# EAGLE design SLIM-PDM (EAGLE 6.1)
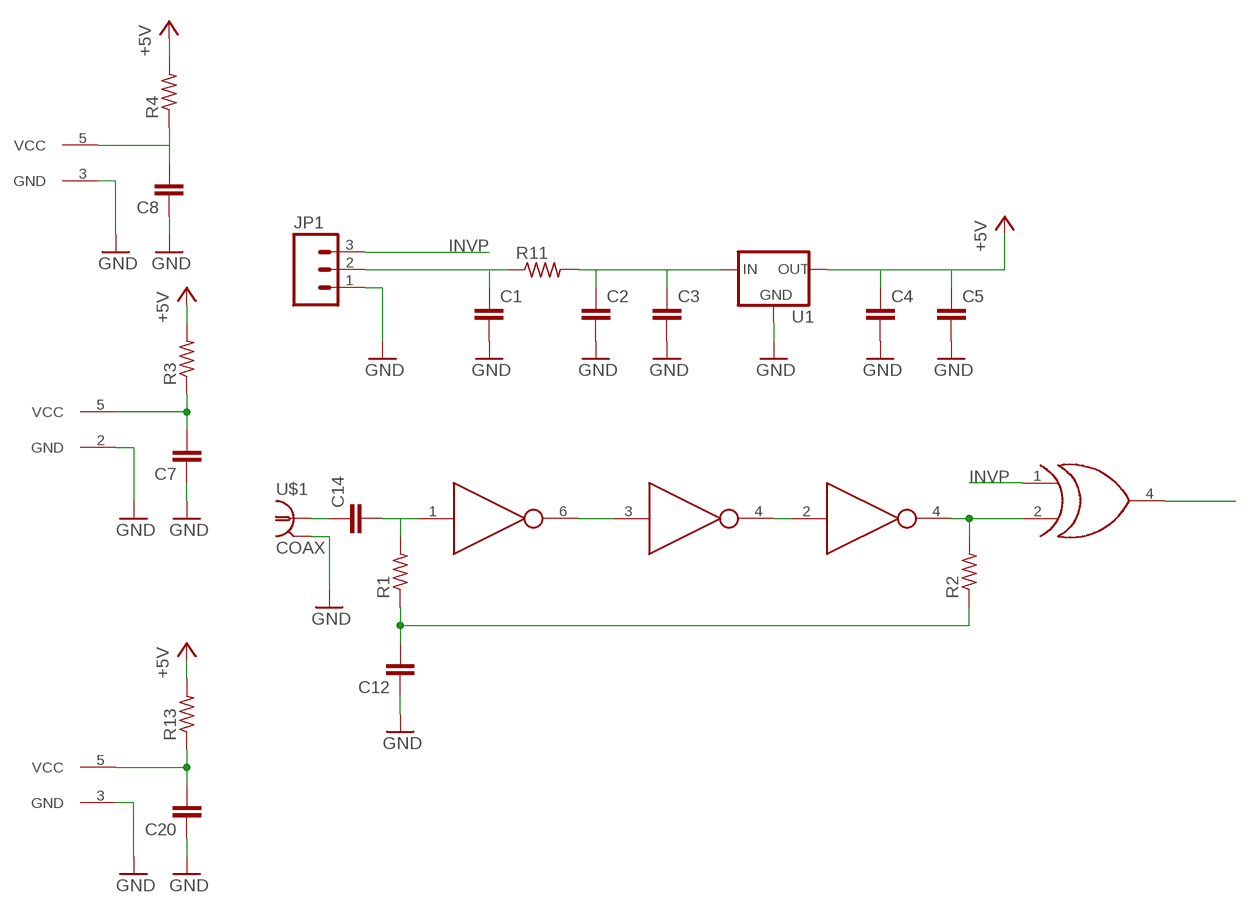
[diagram p0: schematic, sheet 1]

## Parts
C1  C-EUC0805  [C0805]
C2  C-EUC0805  [C0805]
C3  C-EUC1206  [C1206]
C4  C-EUC0805  [C0805]
C5  C-EUC3216  [C3216]
C7  C-EUC0805  [C0805]
C8  C-EUC0805  [C0805]
C12  C-EUC0805  [C0805]
C14  C-EUC0805  [C0805]
C20  C-EUC0805  [C0805]
JP1  M03PTH  [1X03]
R1  R-US_R0805  [R0805]
R2  R-US_R0805  [R0805]
R3  R-US_R0805  [R0805]
R4  R-US_R0805  [R0805]
R11  R-US_R0805  [R0805]
R13  R-US_R0805  [R0805]
U1  78MXXLSOT-89  [SOT89-BCE]
U2  7WZU04  [SC70-6L]
U3  7SZ04  7SZ04SOT-23  [SOT23-5L]
U$1  COAX  [SLIM_COAX_PAD]
U$2  74LVC1G86  [SOT23-5L]

## Nets
+5V: C4.1 C5.1 R3.2 R4.2 R13.2 U1.B(OUT)
GND: C1.2 C2.2 C3.2 C4.2 C5.2 C7.1 C8.1 C12.1 C20.1 JP1.1 U1.C(GND) U2.2(GND) U3.3(GND) U$1.P$2(GND) U$2.3(GND)
INVP: JP1.3 U$2.1(A)
N$1: C14.1 U$1.P$1
N$2: C1.1 JP1.2 R11.1
N$3: C2.1 C3.1 R11.2 U1.E(IN)
N$4: C14.2 R1.2 U2.1(IN)
N$5: U2.3(IN) U2.6(OUT)
N$6: U2.4(OUT) U3.2(IN)
N$7: C7.2 R3.1 U2.5(VCC)
N$8: C12.2 R1.1 R2.1
N$9: C20.2 R13.1 U3.5(VCC)
N$10: R2.2 U3.4(OUT) U$2.2(B)
N$11: U$2.4(Y)
N$12: C8.2 R4.1 U$2.5(VCC)

## Library data of the parts
C1-C5 C7 C8 C12 C14 C20 = rcl:C-EU: CAPACITOR, European symbol
JP1 = SparkFun:M03: Header 3 Standard 3-pin 0.1" header. Use with straight break away headers (SKU : PRT-00116), right angle break away headers (PRT-00553), swiss pins (PRT-00743), machine pins (PRT-00117), and female headers (PRT-00115). Molex polarized connector foot print use with SKU : PRT-08232 with associated crimp pins and housings.
R1-R4 R11 R13 = rcl:R-US_: RESISTOR, American symbol
U1 = SLIM:78MXXL: VOLTAGE REGULATOR
U2 = SLIM:7WZU04
U3 = SLIM:7SZ04
U$1 = SLIM:COAX
U$2 = SLIM:74LVC1G86

## Board
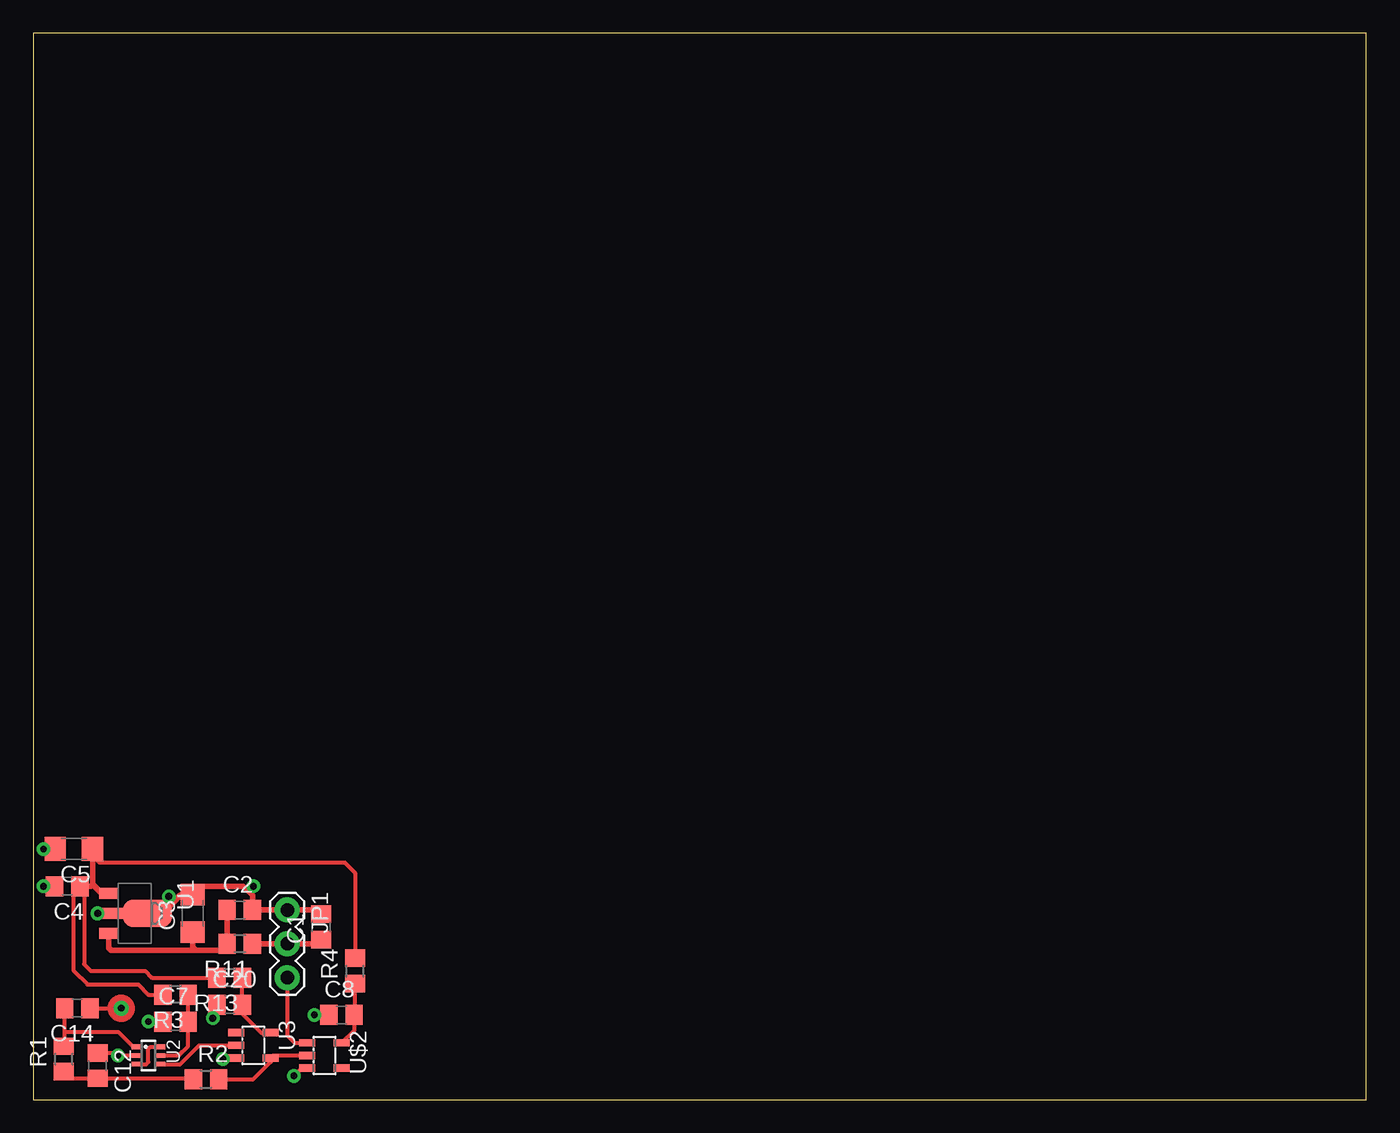
[diagram p1: board, top side]
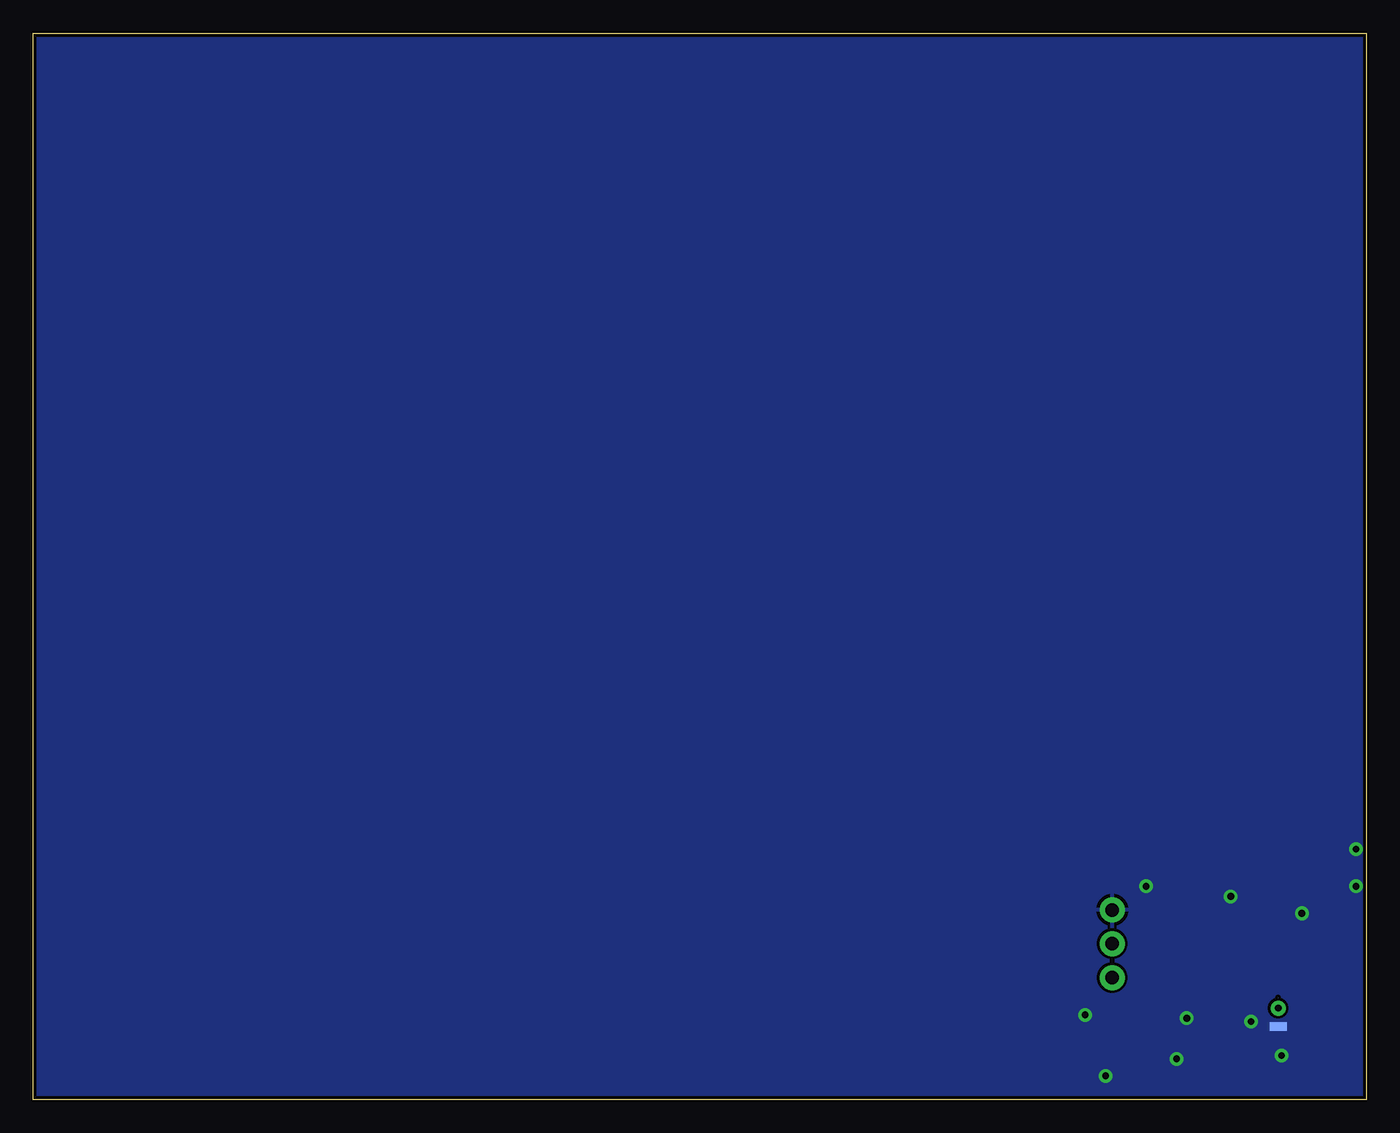
[diagram p2: board, bottom side, seen from below]

Size 100 x 80 mm. Coordinates in mm from the lower left corner, seen from the top.
Outline: 0,0 100,0 100,80 0,80 0,0
Copper layers (1*16): Top 0.035mm / dielectric 1.5mm / Bottom 0.035mm
Design rules: minimum track width 8mil, minimum drill 20mil, track to track 8mil, track to pad 8mil, pad to pad 8mil, via to via 8mil, smd to smd 8mil, copper to edge 10mil, drill to drill 8mil, minimum pad ring 12mil, minimum via ring 10mil, stop-mask expansion 4mil, vias tented up to drill 25mil, thermal gap 10mil

### Footprints (pad centres in the part's own frame; a part is rotated, then mirrored left to right if it is on the bottom)
C0805 = smd 1.3 x 1.5: 1 -0.95,0; 2 0.95,0
C1206 = smd 1.6 x 1.8: 1 -1.4,0; 2 1.4,0
C3216 = smd 1.6 x 1.8: 1 -1.4,0; 2 1.4,0
1X03 = drill 1.016 pad 1.88: 1 0,0; 2 2.54,0; 3 5.08,0
R0805 = smd 1.3 x 1.5: 1 -0.95,0; 2 0.95,0
SOT89-BCE = smd 0.8 x 1.4: B -1.499,-1.981; E 1.499,-1.981 | smd 0.8 x 1.9: C 0,-1.727 | smd 2.032 x 3.65: C@1 0,0.94
SC70-6L = smd 0.35 x 0.8: 1 -0.65,-0.85; 2 0,-0.85; 3 0.65,-0.85; 4 0.65,0.85; 5 0,0.85; 6 -0.65,0.85
SOT23-5L = smd 0.55 x 1.2: 1 -0.95,-1.3; 2 0,-1.3; 3 0.95,-1.3; 4 0.95,1.3; 5 -0.95,1.3
SLIM_COAX_PAD = drill 0.508 pad 1.016: P$1 0,0 | smd 1.27 x 0.635 bottom: P$2 0,-1.397

### Placement (x,y rotation side)
C1  21.59,12.95 90 top
C2  15.49,14.22 0 top
C3  11.94,13.97 90 top
C4  2.54,16 180 top
C5  3.05,18.8 180 top
C7  10.67,5.84 0 top
C8  23.11,6.35 0 top
C12  4.83,2.54 270 top
C14  3.3,6.86 180 top
C20  14.73,7.11 0 top
JP1  19.05,14.22 270 top
R1  2.29,3.05 90 top
R2  12.95,1.52 0 top
R3  10.67,7.87 180 top
R4  24.13,9.65 90 top
R11  15.49,11.68 180 top
R13  14.73,9.14 180 top
U1  7.62,13.97 270 top
U2  8.64,3.3 270 top
U3  16.51,4.06 270 top
U$1  6.6,6.86 0 top
U$2  21.84,3.3 270 top

### Tracks (layer width: path | path; a pad name or v marks a point on that pad's centre or on a via)
+5V
  Top 0.305: R3.2 8.64,7.87 7.87,8.64 4.06,8.64 3.05,9.65 3.05,15.56 C4.1 3.81,15.68 3.81,10.16 4.32,9.65 8.38,9.65 8.89,9.14 R13.2 | R4.2 24.13,17.02 23.37,17.78 4.96,17.78 4.45,18.29
  Top 0.406: 4.45,16.13 4.45,18.29 C5.1 | 4.45,16.13 5.08,15.49 5.61,15.49 U1.B | C4.1 4.32,16 4.45,16.13
GND  (via drill 0.51)
  Top 0.305: U2.2 v6.35,3.3 6.16,3.49 C12.1 | C20.1 13.78,6.42 v13.46,6.1 | C7.1 v8.64,5.84 | U3.3 14.34,3.16 v14.22,3.05 | C4.2 v0.76,16 | C5.2 v0.76,18.8 | C8.1 v21.08,6.35 | U$2.3 20.13,2.35 v19.56,1.78
  Top 0.406: C1.2 21.59,14.22 JP1.1 C2.2 16.44,15.31 15.75,16 12.57,16 C3.2 11.05,15.37 9.65,13.97 U1.C
  other vias: 4.83,13.97 10.16,15.24 16.51,16
  pour Bottom: 0,80.01 100.08,80.01 100.08,0 0,0
INVP
  Top 0.305: U$2.1 19.62,4.25 19.05,4.83 JP1.3
N$1
  Top 0.305: C14.1 U$1.P$1
N$2
  Top 0.406: R11.1 JP1.2 21.59,11.68 C1.1
N$3
  Top 0.406: U1.E 5.64,11.38 5.84,11.18 12.19,11.18 | 12.19,11.18 14.04,11.18 R11.2 C2.1 | C3.1 11.94,11.43 12.19,11.18
N$4
  Top 0.305: 2.35,4.06 2.35,5.08 | 2.35,5.08 C14.2 | U2.1 7.48,3.95 6.35,5.08 2.35,5.08
  Top 0.406: R1.2 2.35,4.06
N$5
  Top 0.305: U2.3 8.49,2.65 8.64,2.79 8.64,3.81 8.78,3.95 U2.6
N$6
  Top 0.305: U2.4 11.03,2.65 12.45,4.06 U3.2
N$7
  Top 0.305: U2.5 10.92,3.3 11.62,4 C7.2 R3.1
N$8
  Top 0.305: R1.1 2.79,1.59 C12.2 11.94,1.59
  Top 0.406: 11.94,1.59 R2.1
N$9
  Top 0.305: R13.1 C20.2 15.68,6.42 17.08,5.01 U3.5
N$10
  Top 0.305: R2.2 16.51,1.52 17.81,2.82 U3.4 18,3.3 U$2.2
N$12
  Top 0.305: R4.1 24.13,6.42 C8.2 24.06,5.17 U$2.5